# Altium schematic sheet TDA2030.SchDoc
size A; SheetNumber: 1; SheetTotal: 1
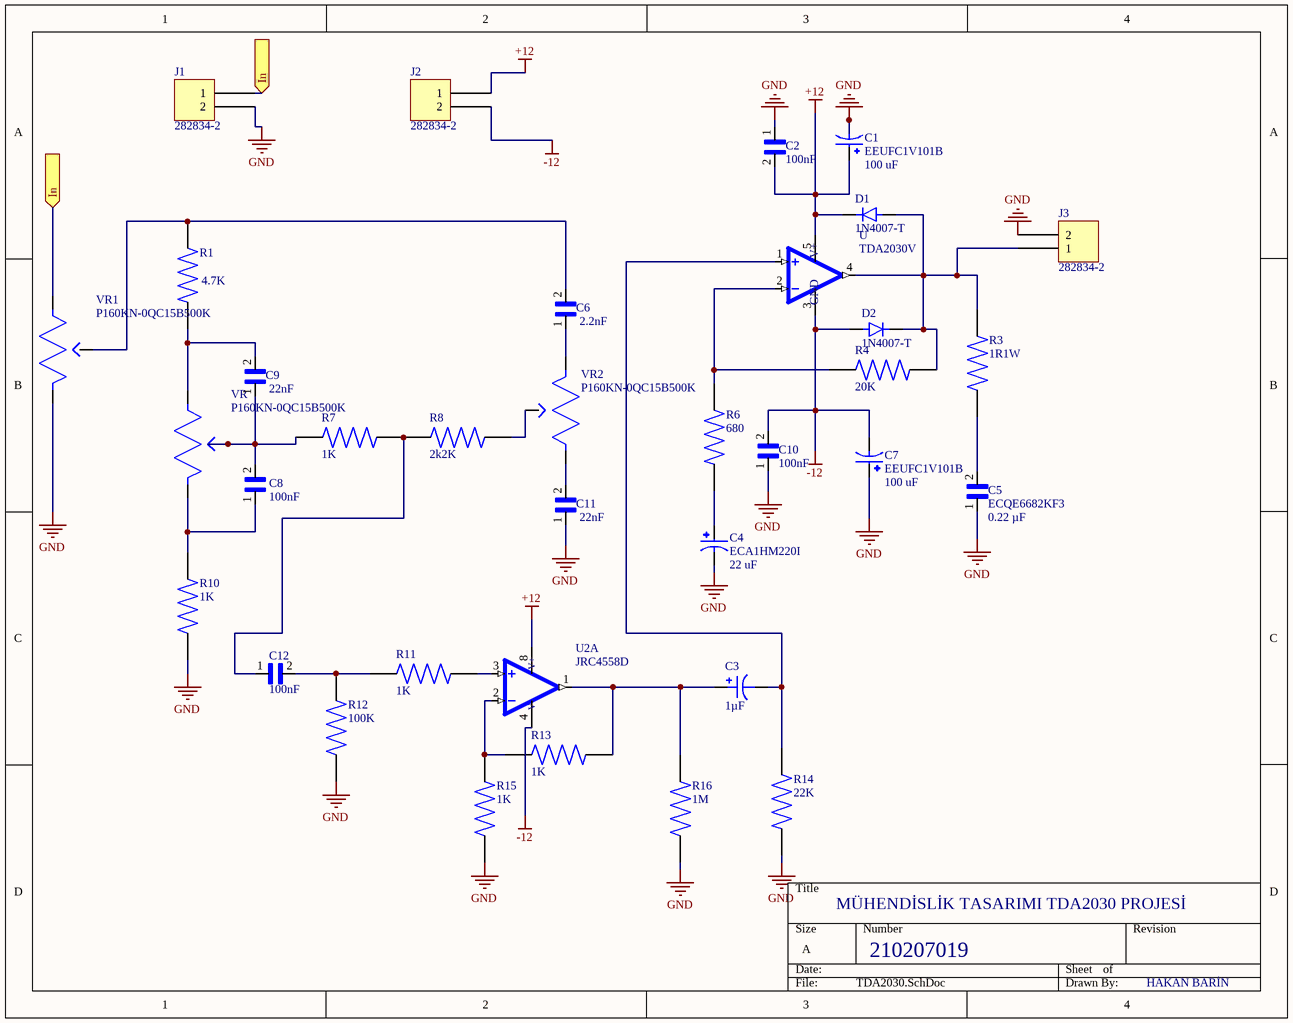
[diagram p0: TDA2030.SchDoc]

## Parts
C1  EEUFC1V101B  value 100 uF  [CAPPRD500W60D800H1150]
C2  value 100nF  [CAPRB500W50L450T300H550]
C3  1µF  [CAP TH ALUM ELEC D5.00mm S2.00mm H11.00mm]
C4  ECA1HM220I  value 22 uF  [CAPPRD250W50D500H1100]
C5  ECQE6682KF3  value 0.22 µF  [CAPRR500W60L1200T490H1500]
C6  value 2.2nF  [CAPRB500W50L450T300H550]
C7  EEUFC1V101B  value 100 uF  [CAPPRD500W60D800H1150]
C8  value 100nF  [CAPRB500W50L450T300H550]
C9  value 22nF  [CAPRB500W50L450T300H550]
C10  value 100nF  [CAPRB500W50L450T300H550]
C11  value 22nF  [CAPRB500W50L450T300H550]
C12  value 100nF  [CAPRB500W50L450T300H550]
D1  1N4007-T  [DIOAD780W78L463D236]
D2  1N4007-T  [DIOAD780W78L463D236]
J1  282834-2  [TE 282834-2]
J2  282834-2  [TE 282834-2]
J3  282834-2  [TE 282834-2]
R1  4.7K  [RESAD1100W55L680D260]
R3  1R1W  [RESAD1100W55L680D260]
R4  20K  [RESAD1100W55L680D260]
R6  680  [RESAD1100W55L680D260]
R7  1K  [RESAD1100W55L680D260]
R8  2k2K  [RESAD1100W55L680D260]
R10  1K  [RESAD1100W55L680D260]
R11  1K  [RESAD1100W55L680D260]
R12  100K  [RESAD1100W55L680D260]
R13  1K  [RESAD1100W55L680D260]
R14  22K  [RESAD1100W55L680D260]
R15  1K  [RESAD1100W55L680D260]
R16  1M  [RESAD1100W55L680D260]
U  TDA2030V  [CB360]
U2  JRC4558D  [DIP762W46P254L880H425Q8]  (part A of 2)
VR  P160KN-0QC15B500K  [P160]
VR1  P160KN-0QC15B500K  [P160]
VR2  P160KN-0QC15B500K  [P160]

## Ports
In (in, see TDA2030[1A])

## Nets
+12: C1.P C2.2 D1.K J2.1 U.5(V+) U2.8(V+)
-12: C7.N C10.2 D2.A J2.2 U.3(GND) U2.4(V-)
GND: C1.N C2.1 C4.N C5.1 C7.P C10.1 C11.1 J1.2 J3.2 R10.2 R12.2 R14.2 R15.2 R16.2 VR1.1
In: J1.1 VR1.3 ; port In
NetC3_1: C3.1 R13.2 R16.1 U2.1(OUT)
NetC3_2: C3.2 R14.1 U.1(+IN)
NetC4_P: C4.P R6.2
NetC5_2: C5.2 R3.2
NetC6_1: C6.1 VR2.1
NetC6_2: C6.2 R1.2 VR1.2
NetC8_1: C8.1 R10.1 VR.1
NetC8_2: C8.2 C9.1 R7.2 VR.2
NetC9_2: C9.2 R1.1 VR.3
NetC11_2: C11.2 VR2.3
NetC12_1: C12.1 R7.1 R8.2
NetC12_2: C12.2 R11.1 R12.1
NetD1_A: D1.A D2.K J3.1 R3.1 R4.2 U.4(OUT)
NetR4_1: R4.1 R6.1 U.2(-IN)
NetR8_1: R8.1 VR2.2
NetR11_2: R11.2 U2.3(+IN)
NetR13_1: R13.1 R15.1 U2.2(-IN)

## Notes on the sheet
- MÜHENDİSLİK TASARIMI TDA2030 PROJESİ
- 210207019
- HAKAN BARİN

## Library data of the parts
C1 C7 = EEUFC1V101B: 100F 35V Aluminum Electrolytic Capacitors Radial, Can 2000 Hrs @ 105C; MF: Panasonic; Package: RADIAL-2 Panasonic; Check_prices: https://www.snapeda.com/parts/EEUFC1V101B/Panasonic/view-part/?ref=eda; SnapEDA_Link: https://www.snapeda.com/parts/EEUFC1V101B/Panasonic/view-part/?ref=snap; Price: None; Availability: Not in stock; MP: EEUFC1V101B
C2 C6 C8-C12 = FG24X7R1H105KRT06: Cap Ceramic 1uF 50V X7R 10% Radial 5mm 125Â°C Tape; MF: TDK; Package: Radial TDK; Price: None; SnapEDA_Link: https://www.snapeda.com/parts/FG24X7R1H105KRT06/TDK/view-part/?ref=snap; Purchase-URL: https://pricing.snapeda.com/search/part/FG24X7R1H105KRT06/?ref=eda; Check_prices: https://www.snapeda.com/parts/FG24X7R1H105KRT06/TDK/view-part/?ref=eda; MP: FG24X7R1H105KRT06; Availability: In Stock
C3 = RFS-50V010ME3#5: CAP ALUM 1UF 20% 50V RADIAL; manufacturer: Elna America; Lifetime @ Temp.: 1000 Hrs @ 85°C; Polarization: Polar; Ripple Current @ Low Frequency: 14mA @ 120Hz; Part Number: RFS-50V010ME3#5; Applications: Audio; Capacitance: 1µF; componentlink1description: Datasheet; componentlink1url: http://www.elna.co.jp/en/capacitor/alumi/catalog/pdf/rfs_e.pdf; componentlink2description: DigiKey Link; componentlink2url: http://digikey.com/product-detail/en/elna-america/RFS-50V010ME3-5/604-1117-ND/2171168; Device Package: Radial, Can; Height - Seated (Max): 0.433" (11.00mm); lastupdated: 9/4/2020 11:28:56 PM; Lead Spacing: 0.079" (2.00mm); Lifecycle Status: Active; Minimum Order: 1; Mounting Type: Through Hole; Operating Temperature: -40°C ~ 85°C; Package / Case: Radial, Can; packaging: Bulk; partid: 21459; Part Status: Active; price: 0.30; series: RFS, SILMIC II; Size / Dimension: 0.197" Dia (5.00mm); Supplier 1: DigiKey; Supplier Part Number 1: 604-1117-ND; Tolerance: ±20%; value: 1µF; Voltage - Rated: 50V
C4 = ECA1HM220I: Capacitor,Alum Lytic,Cap 22 uF,Tol 20%,Vol-Rtg 50 VDC,Radial,5x11,Tape&Box | Panasonic Electronic Components ECA-1HM220I; SnapEDA_Link: https://www.snapeda.com/parts/ECA-1HM220I/Panasonic/view-part/?ref=snap; Package: RADIAL-2 Panasonic; MF: Panasonic; MP: ECA-1HM220I; Check_prices: https://www.snapeda.com/parts/ECA-1HM220I/Panasonic/view-part/?ref=eda
D1 D2 = 1N4007-T: Diode Standard 1A 1000V 1Vf DO41 | Diodes Inc 1N4007-T; MF: Diodes Incorporated; SnapEDA_Link: https://www.snapeda.com/parts/1N4007-T/Diodes+Inc./view-part/?ref=snap; Package: DO-41 Diodes Inc.; Value: *; MP: 1N4007-T; Check_prices: https://www.snapeda.com/parts/1N4007-T/Diodes+Inc./view-part/?ref=eda
J1-J3 = 282834-2: TERM BLK 2P SIDE ENT 2.54MM PCB; Manufacturer: TE Connectivity AMP Connectors; Current: 10A; Mating Orientation: Horizontal with Board; Number of Levels: 1; Pitch: 0.100" (2.54mm); Positions Per Level: 2; Voltage: 150V; Wire Gauge: 16-30 AWG; Wire Termination: Screw - Rising Cage Clamp; Part Number: 282834-2; Color: Green; ComponentLink1Description: Datasheet; ComponentLink1URL: https://www.te.com/commerce/DocumentDelivery/DDEController?Action=srchrtrv&DocNm=282834&DocType=Customer+Drawing&DocLang=English; ComponentLink2Description: DigiKey Link; ComponentLink2URL: http://digikey.com/product-detail/en/te-connectivity-amp-connectors/282834-2/A98333-ND/1150135; LastUpdated: 1/15/2020 4:15:38 AM; Lifecycle Status: Active; Minimum Order: 1; Mounting Type: Through Hole; Packaging: Bulk; Part Status: Active; Price: 0.88; Series: Buchanan; Supplier 1: DigiKey; Supplier Part Number 1: A98333-ND
R1 R7 R10 R12 = MFR-25FBF52-1K: 1.07 kOhms Â±1% 0.25W, 1/4W Through Hole Resistor Axial - Metal Film; MF: Yageo; SnapEDA_Link: https://www.snapeda.com/parts/MFR-25FBF52-1K/Yageo/view-part/?ref=snap; Purchase-URL: https://pricing.snapeda.com/search/part/MFR-25FBF52-1K/?ref=eda; Availability: In Stock; Price: None; Package: Axial Yageo; Check_prices: https://www.snapeda.com/parts/MFR-25FBF52-1K/Yageo/view-part/?ref=eda; MP: MFR-25FBF52-1K
  R1 R10: Value: *
  R7: Value: 1K
  R12: Value: 100K
R3 R4 R6 R8 R13-R16 = MFR-25FBF52-1K: 1.07 kOhms Â±1% 0.25W, 1/4W Through Hole Resistor Axial - Metal Film; Value: 2.2K; MF: Yageo; SnapEDA_Link: https://www.snapeda.com/parts/MFR-25FBF52-1K/Yageo/view-part/?ref=snap; Purchase-URL: https://pricing.snapeda.com/search/part/MFR-25FBF52-1K/?ref=eda; Availability: In Stock; Price: None; Package: Axial Yageo; Check_prices: https://www.snapeda.com/parts/MFR-25FBF52-1K/Yageo/view-part/?ref=eda; MP: MFR-25FBF52-1K
R11 = MFR-25FBF52-1K: 1.07 kOhms Â±1% 0.25W, 1/4W Through Hole Resistor Axial - Metal Film; Value: 100K; MF: Yageo; SnapEDA_Link: https://www.snapeda.com/parts/MFR-25FBF52-1K/Yageo/view-part/?ref=snap; Purchase-URL: https://pricing.snapeda.com/search/part/MFR-25FBF52-1K/?ref=eda; Availability: In Stock; Price: None; Package: Axial Yageo; Check_prices: https://www.snapeda.com/parts/MFR-25FBF52-1K/Yageo/view-part/?ref=eda; MP: MFR-25FBF52-1K
U = TDA2030V: Amplifier IC 1-Channel _Mono_ Class AB 5-PENTAWATT; MF: STMicroelectronics; MP: TDA2030V; Value: *; SnapEDA_Link: https://www.snapeda.com/parts/TDA2030V/STMicroelectronics/view-part/814468/?ref=snap; Package: Pentawatt-5 STMicroelectronics; Availability: Unavailable; Price: None
U2 = JRC4558D: Dip8; MF: New Japan Radio; Availability: Unavailable; SnapEDA_Link: https://www.snapeda.com/parts/JRC4558D/New%20Japan%20Radio/view-part/424120/?ref=snap; MP: JRC4558D; Price: None; Package: DIP-8 New Japan Radio; Value: *
VR VR1 VR2 = P160KN-0QC15B500K: 500k Ohm 1 Gang Linear Panel Mount Potentiometer None 1 Turn Conductive Plastic 0.2W, 1/5W PC Pins; MF: TT Electronics/BI; Value: *; Digi-Key_Part_Number: 987-1304-ND; Package: None; Digi-Key_Purchase_URL: https://www.digikey.cz/product-detail/en/tt-electronics-bi/P160KN-0QC15B500K/987-1304-ND/2408881?utm_source=snapeda&utm_medium=aggregator&utm_campaign=symbol; MP: P160KN-0QC15B500K; SnapEDA_Link: https://www.snapeda.com/parts/P160KN-0QC15B500K/TT%20Electronics/BI/view-part/903272/?ref=snap
C5 = ECQE6682KF3: Availability: Unavailable; Package: None; Price: None; MP: ECQE6682KF3